# Altium schematic sheet WARG EE Bootcamp.SchDoc
size 431 x 279 mm; SheetNumber: 1; SheetTotal: 1
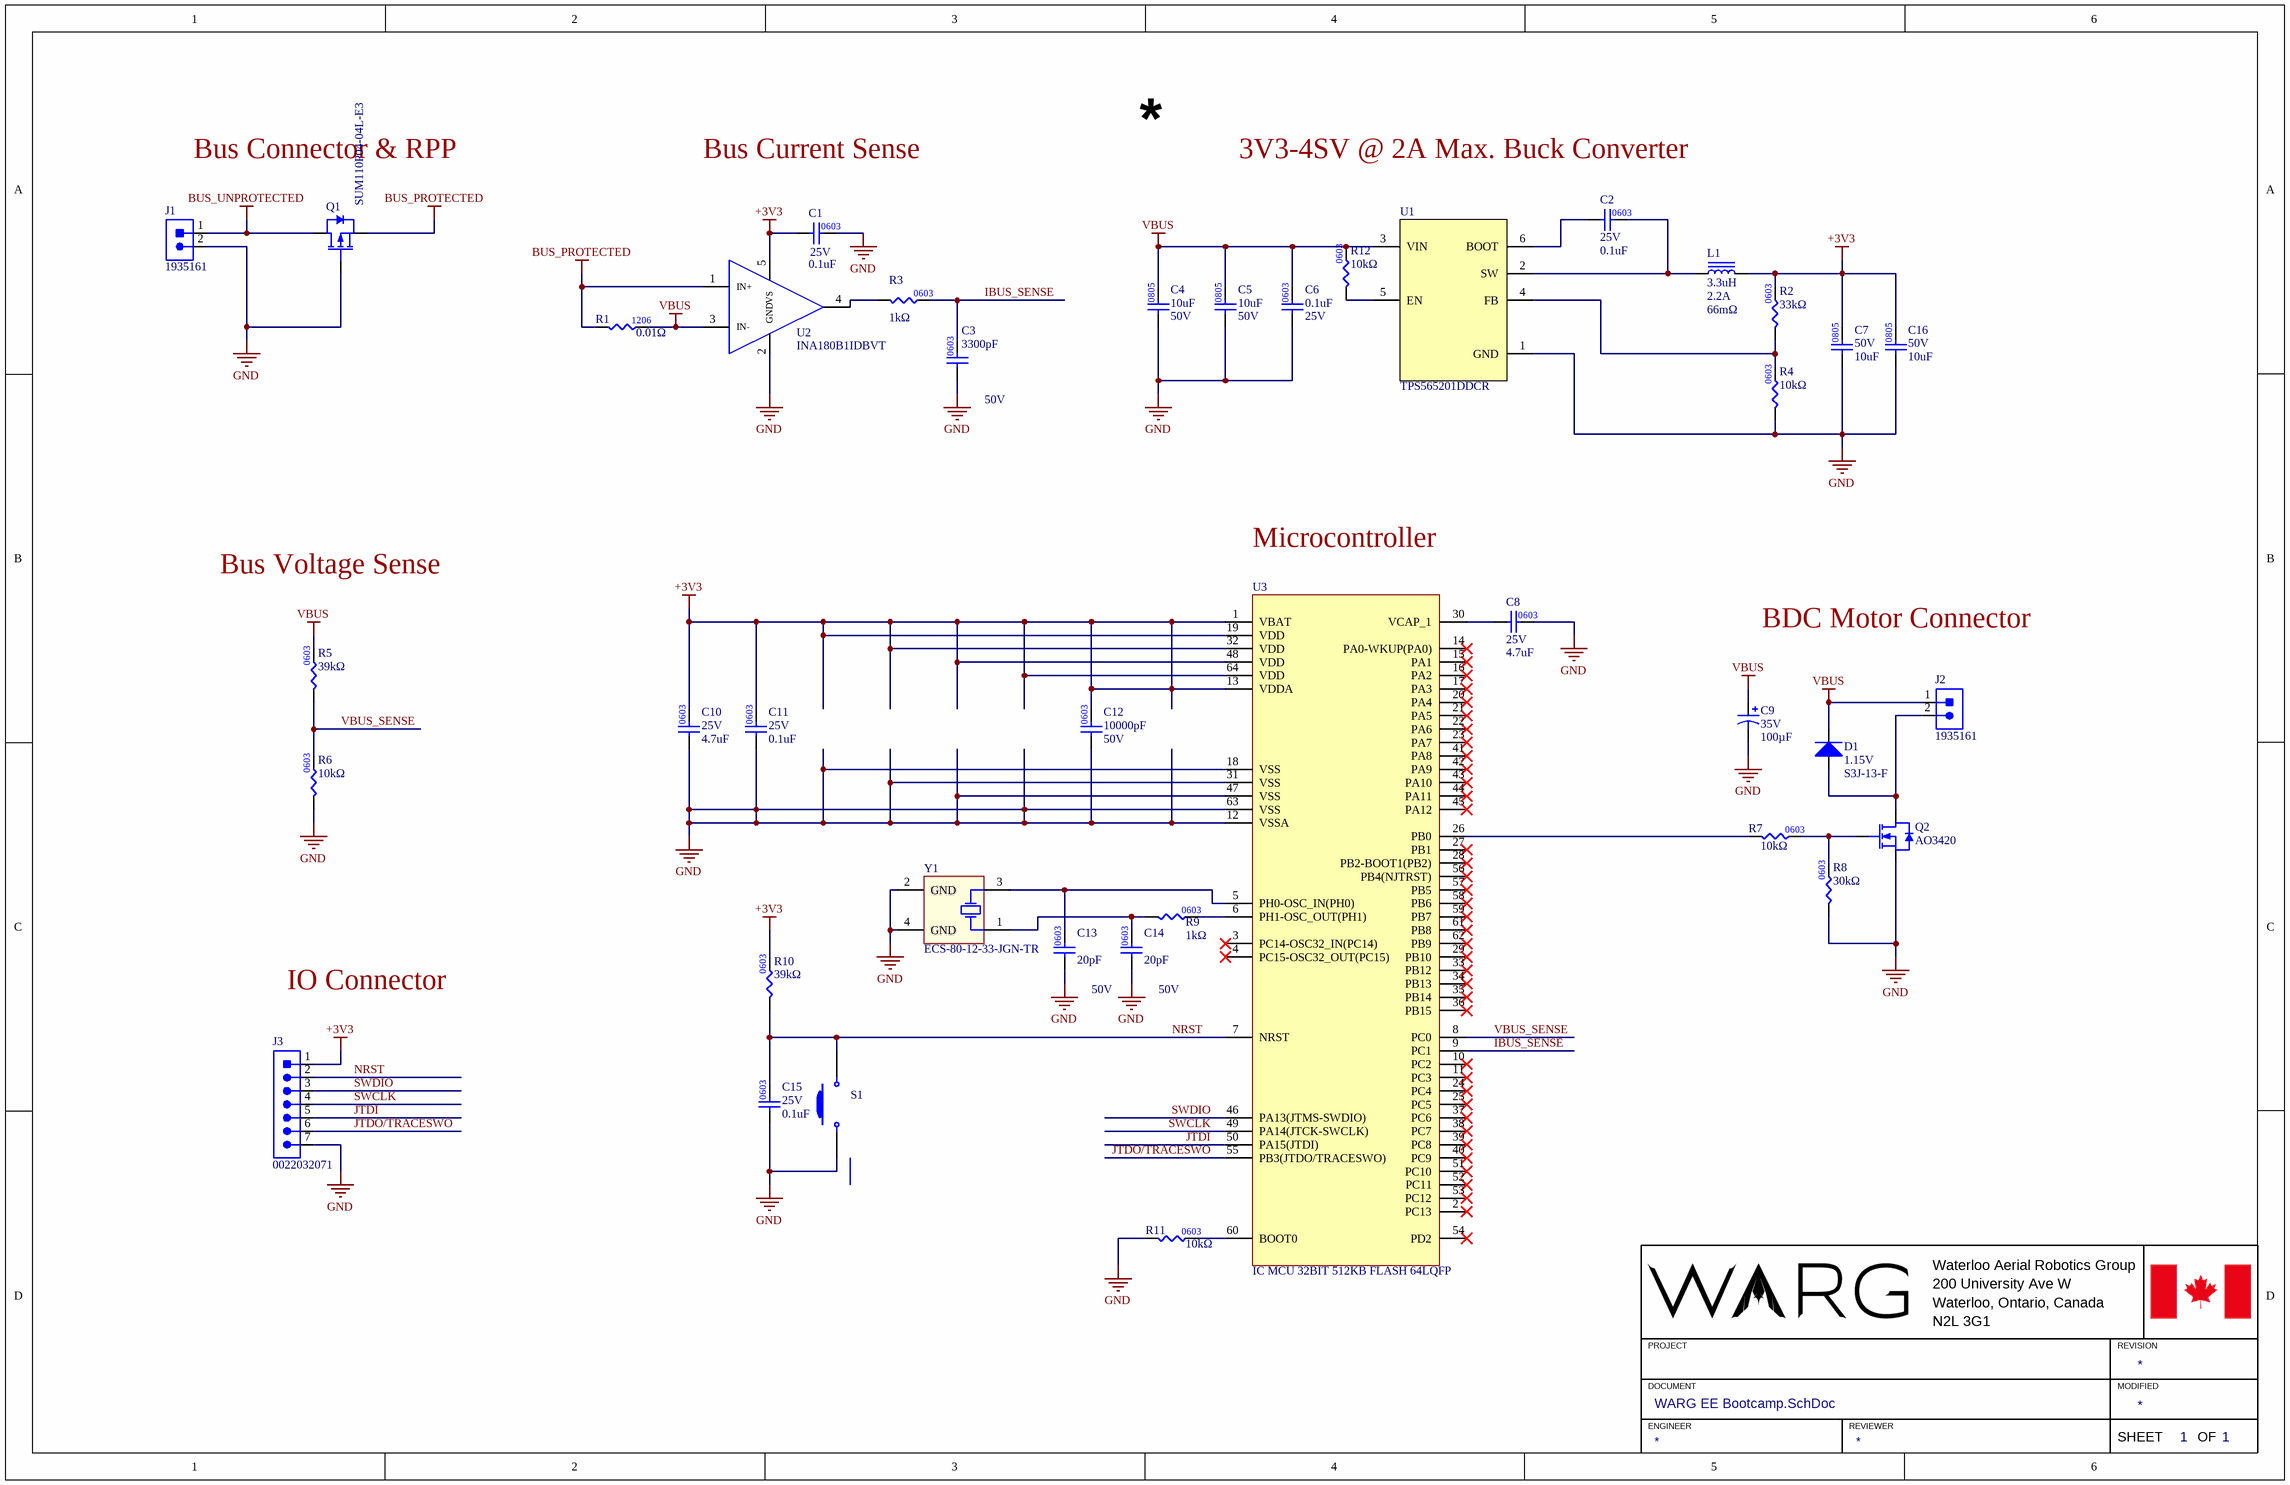
[diagram p0: WARG EE Bootcamp.SchDoc]

## Parts
C1  value 0.1uF  Voltage: 25V  [CAP0603]  (hidden comment: CAP CER 0.1UF 25V X7R ±10% 0603)
C2  value 0.1uF  Voltage: 25V  [CAP0603]  (hidden comment: CAP CER 0.1UF 25V X7R ±10% 0603)
C3  value 3300pF  Voltage Rating: 50V  [CAP0603]  (hidden comment: CAP CER 3300PF 50V C0G/NP0 0603)
C4  value 10uF  Voltage: 50V  [CAP0805]  (hidden comment: CAP CER 10UF 50V X5R ±10% 0805)
C5  value 10uF  Voltage: 50V  [CAP0805]  (hidden comment: CAP CER 10UF 50V X5R ±10% 0805)
C6  value 0.1uF  Voltage: 25V  [CAP0603]  (hidden comment: CAP CER 0.1UF 25V X7R ±10% 0603)
C7  value 10uF  Voltage: 50V  [CAP0805]  (hidden comment: CAP CER 10UF 50V X5R ±10% 0805)
C8  value 4.7uF  Voltage: 25V  [CAP0603]  (hidden comment: CAP CER 4.7UF 25V X6S ±10% 0603)
C9  value 100µF  Voltage Rating: 35V  [RADIAL_CORNELL_D]  (hidden comment: CAP ALUM 100UF 20% 35V SMD)
C10  value 4.7uF  Voltage: 25V  [CAP0603]  (hidden comment: CAP CER 4.7UF 25V X6S ±10% 0603)
C11  value 0.1uF  Voltage: 25V  [CAP0603]  (hidden comment: CAP CER 0.1UF 25V X7R ±10% 0603)
C12  value 10000pF  Voltage Rating: 50V  [CAP0603]  (hidden comment: CAP CER 10000PF 50V X7R 0603)
C13  value 20pF  Voltage Rating: 50V  [CAP0603]  (hidden comment: CAP CER 20PF 50V C0G/NP0 0201)
C14  value 20pF  Voltage Rating: 50V  [CAP0603]  (hidden comment: CAP CER 20PF 50V C0G/NP0 0201)
C15  value 0.1uF  Voltage: 25V  [CAP0603]  (hidden comment: CAP CER 0.1UF 25V X7R ±10% 0603)
C16  value 10uF  Voltage: 50V  [CAP0805]  (hidden comment: CAP CER 10UF 50V X5R ±10% 0805)
D1  Forward Voltage: 1.15V  Manufacturer Part Number 1: S3J-13-F  [SMC]  (hidden comment: DIODE GEN PURP 600V 3A SMC)
J1  CON_2POS_SCREW_TERM  [1935161]  (value not drawn)
J2  CON_2POS_SCREW_TERM  [1935161]  (value not drawn)
J3  CONN HEADER VERT 7POS 2.54MM  [0022284070]  (value not drawn)
L1  value 3.3uH  Current Rating: 2.2A  DC Resistance: 66mΩ
Q1  SUM110P04-04L-E3  [TO-263 (D²Pak)]  (value not drawn)
Q2  MOSFET N-CH 20V 6A SOT23-3L  [SOT23-3]  (value not drawn)
R1  value 0.01Ω  [RES1206]
R2  value 33kΩ  [RES0603]  (hidden comment: RES 33K OHM 1% 1/10W 0603)
R3  value 1kΩ  [RES0603]  (hidden comment: RES 1K OHM 1% 1/10W 0603)
R4  value 10kΩ  [RES0603]  (hidden comment: RES 10K OHM 1% 1/10W 0603)
R5  value 39kΩ  [RES0603]  (hidden comment: RES 39K OHM 1% 1/10W 0603)
R6  value 10kΩ  [RES0603]  (hidden comment: RES 10K OHM 1% 1/10W 0603)
R7  value 10kΩ  [RES0603]  (hidden comment: RES 10K OHM 1% 1/10W 0603)
R8  value 30kΩ  [RES0603]  (hidden comment: RES 30K OHM 1% 1/10W 0603)
R9  value 1kΩ  [RES0603]  (hidden comment: RES 1K OHM 1% 1/10W 0603)
R10  value 39kΩ  [RES0603]
R11  value 10kΩ  [RES0603]  (hidden comment: RES 10K OHM 1% 1/10W 0603)
R12  value 10kΩ  [RES0603]  (hidden comment: RES 10K OHM 1% 1/10W 0603)
S1  435151014824  [435151014824]  (value not drawn)
U1  IC REG BUCK ADJ 5A TSOT23-6  [SOT23-6]  (value not drawn)
U2  IC CURR SENSE 1 CIRCUIT SOT23-5  [SOT23-5]  (value not drawn)
U3  IC MCU 32BIT 512KB FLASH 64LQFP  [STM_LQFP64_N]
Y1  CRYSTAL 8MHZ 12PF SMD  (value not drawn)

## Nets
+3V3: C1.1 C7.2 C10.2 C11.2 C12.2 C16.2 J3.1 L1.2 R2.2 R10.2 U2.5(VS) U3.1(VBAT) U3.13(VDDA) U3.19(VDD) U3.32(VDD) U3.48(VDD) U3.64(VDD)
BUS_PROTECTED: Q1.1(Source) R1.1 U2.1(IN+)
BUS_UNPROTECTED: J1.1 Q1.3(Drain)
GND: C1.2 C3.1 C4.1 C5.1 C6.1 C7.1 C8.2 C9.2 C10.1 C11.1 C12.1 C13.1 C14.1 C15.1 C16.1 J1.2 J3.7 Q1.2(Gate) Q2.1(Source) R4.1 R6.1 R8.1 R11.1 S1.1 U1.1(GND) U2.2(GND) U3.12(VSSA) U3.18(VSS) U3.31(VSS) U3.47(VSS) U3.63(VSS) Y1.2(GND) Y1.4(GND)
VBUS: C4.2 C5.2 C6.2 C9.1 D1.2(K) J2.1 R1.2 R5.2 R12.2 U1.3(VIN) U2.3(IN-)
IBUS_SENSE: C3.2 R3.2 U3.9(PC1)
JTDI: J3.5 U3.50(PA15(JTDI))
JTDO/TRACESWO: J3.6 U3.55(PB3(JTDO/TRACESWO))
NRST: C15.2 J3.2 R10.1 S1.2 U3.7(NRST)
SWCLK: J3.4 U3.49(PA14(JTCK-SWCLK))
SWDIO: J3.3 U3.46(PA13(JTMS-SWDIO))
VBUS_SENSE: R5.1 R6.2 U3.8(PC0)
NetC2_1: C2.1 U1.6(BOOT)
NetC2_2: C2.2 L1.1 U1.2(SW)
NetC8_1: C8.1 U3.30(VCAP_1)
NetC13_2: C13.2 U3.5(PH0-OSC_IN(PH0)) Y1.3(OUT/IN)
NetC14_2: C14.2 R9.1 Y1.1(IN/OUT)
NetD1_1: D1.1(A) J2.2 Q2.3(Drain)
NetQ2_2: Q2.2(Gate) R7.2 R8.2
NetR2_1: R2.1 R4.2 U1.4(FB)
NetR3_1: R3.1 U2.4(OUT)
NetR7_1: R7.1 U3.26(PB0)
NetR9_2: R9.2 U3.6(PH1-OSC_OUT(PH1))
NetR11_2: R11.2 U3.60(BOOT0)
NetR12_1: R12.1 U1.5(EN)

Not connected (* = marked no-connect by the designer): U3 2(PC13)* 3(PC14-OSC32_IN(PC14))* 4(PC15-OSC32_OUT(PC15))* 10(PC2)* 11(PC3)* 14(PA0-WKUP(PA0))* 15(PA1)* 16(PA2)* 17(PA3)* 20(PA4)* 21(PA5)* 22(PA6)* 23(PA7)* 24(PC4)* 25(PC5)* 27(PB1)* 28(PB2-BOOT1(PB2))* 29(PB10)* 33(PB12)* 34(PB13)* 35(PB14)* 36(PB15)* 37(PC6)* 38(PC7)* 39(PC8)* 40(PC9)* 41(PA8)* 42(PA9)* 43(PA10)* 44(PA11)* 45(PA12)* 51(PC10)* 52(PC11)* 53(PC12)* 54(PD2)* 56(PB4(NJTRST))* 57(PB5)* 58(PB6)* 59(PB7)* 61(PB8)* 62(PB9)*

## Notes on the sheet
- Bus Connector & RPP
- Bus Current Sense
- 3V3-4SV @ 2A Max. Buck Converter
- Microcontroller
- Bus Voltage Sense
- BDC Motor Connector
- IO Connector
- Waterloo Aerial Robotics Group
- 200 University Ave W
- PROJECT
- Waterloo, Ontario, Canada
- N2L 3G1
- REVISION
- DOCUMENT
- ENGINEER
- REVIEWER
- MODIFIED
- SHEET
- OF

## Library data of the parts
C1 C2 C6 C11 C15 = GCM188R71E104KA57D: Manufacturer 1: Murata Electronics; Supplier 1: Digi-Key; Supplier Part Number 1: 490-6051-1-ND; Manufacturer Part Number 1: GCM188R71E104KA57D; Temperature Coefficient: X7R; Package: 0603; Tolerance: ±10%; Mounting Type: SMD
C3 = GRM1885C1H332JA01D: Manufacturer 1: Murata Electronics; Tolerance: ±5%; Temperature Coefficient: C0G; Supplier 1: Digi-Key; Manufacturer Part Number 1: GRM1885C1H332JA01D; Supplier Part Number 1: 490-6385-1-ND; Package: 0603; Mounting Type: SMD; ComponentLink1URL: https://datasheet.ciiva.com/6270/product-6270530.pdf?src-supplier=Digi-Key; ComponentLink1Description: https://datasheet.ciiva.com/6270/product-6270530.pdf?src-supplier=Digi-Key; ComponentLink2URL: https://datasheet.ciiva.com/29202/450783-da-01-en-vs-kondensator-0603-29202805.pdf?src-supplier=Conrad; ComponentLink2Description: https://datasheet.ciiva.com/29202/450783-da-01-en-vs-kondensator-0603-29202805.pdf?src-supplier=Conrad; ComponentLink3URL: https://datasheet.ciiva.com/5417/product-5417082.pdf?src-supplier=Mouser; ComponentLink3Description: https://datasheet.ciiva.com/5417/product-5417082.pdf?src-supplier=Mouser
C4 C5 C7 C16 = GRM21BR61H106KE43L: Manufacturer 1: Murata Electronics; Manufacturer Part Number 1: GRM21BR61H106KE43L; Supplier 1: Digi-Key; Supplier Part Number 1: 490-18663-1-ND; Temperature Coefficient: X5R; Package: 0805; Mounting Type: Surface Mount; Tolerance: ±10%
C8 C10 = GRM188C81E475KE11D: Manufacturer 1: Murata Electronics; Supplier 1: Digi-Key; Supplier Part Number 1: 490-7199-1-ND; Manufacturer Part Number 1: GRM188C81E475KE11D; Tolerance: ±10%; Temperature Coefficient: X6S; Mounting Type: SMD; Package: 0603
C9 = 35TKV100M8X10.5: Manufacturer 1: Rubycon; Manufacturer Part Number 1: 35TKV100M8X10.5; Mounting Type: SMD; Supplier 1: Digi-Key; Supplier Part Number 1: 1189-2074-1-ND; Tolerance: ±20%
C12 = C0603C103J5RAC7867: Manufacturer 1: KEMET; Tolerance: ±5%; Manufacturer Part Number 1: C0603C103J5RAC7867; Package: 0603; Mounting Type: SMD; Temperature Coefficient: X7R; Supplier 1: Digi-Key; Supplier Part Number 1: 399-C0603C103J5RAC7867CT-ND
C13 C14 = GRM0335C1H200GA01D: Manufacturer Part Number 1: GRM1885C1H332JA01D; Manufacturer 1: Murata Electronics; Temperature Coefficient: C0G; Tolerance: ±5%; Supplier 1: Digi-Key; Supplier Part Number 1: 490-6385-1-ND; Package: 0603; Mounting Type: SMD; ComponentLink1URL: https://datasheet.ciiva.com/6270/product-6270530.pdf?src-supplier=Digi-Key; ComponentLink1Description: https://datasheet.ciiva.com/6270/product-6270530.pdf?src-supplier=Digi-Key; ComponentLink2URL: https://datasheet.ciiva.com/29202/450783-da-01-en-vs-kondensator-0603-29202805.pdf?src-supplier=Conrad; ComponentLink2Description: https://datasheet.ciiva.com/29202/450783-da-01-en-vs-kondensator-0603-29202805.pdf?src-supplier=Conrad; ComponentLink3URL: https://datasheet.ciiva.com/5417/product-5417082.pdf?src-supplier=Mouser; ComponentLink3Description: https://datasheet.ciiva.com/5417/product-5417082.pdf?src-supplier=Mouser
D1 = S3J-FDICT-ND: Manufacturer 1: Diodes Incorporated; Reverse Leakage Current: 10 μA @ 600V; Package: SMC; Mounting Type: Surface Mount; Supplier Part Number 1: S3J-FDICT-ND; Continuous Reverse Voltage (Max): 600V; Average Rectified Current: 3A; Supplier 1: Digi-Key
J1 J2 = 1935161: CONN SCREW TERMINAL 2X1 5MM RA TH; Manufacturer 1: Phoenix Contact; Supplier 1: Digi-Key; Mounting Type: TH; Supplier Part Number 1: 277-1667-ND; Pitch: 5mm; Manufacturer Part Number 1: 1935161
J3 = 0022032071: Manufacturer 1: Molex; Number of Positions: 7; Mounting Type: Through Hole; Pitch: 2.54mm; Number of Rows: 1; Connector Type: Header; Contact Type: Male Pin; Supplier 1: Digi-Key; Supplier Part Number 1: WM4005-ND; Manufacturer Part Number 1: 0022032071
L1 = SRN4018-2R2M: FIXED IND 2.2UH 2.9A 44 MOHM SMD; Manufacturer 1: Bourns Inc.; Manufacturer Part Number 1: SRN4018-3R3M; Supplier 1: Digi-Key; Supplier Part Number 1: SRN4018-3R3MCT-ND; Mounting Type: SMD
Q2 = AO3420: Manufacturer 1: Alpha & Omega Semiconductor Inc.; Gate to Source Voltage (Vgs) Max. @ Vgs = 4.5V: ±12V; FET Type: N-Channel; Drain to Source Resistance On (Rds(on)) Max.: 24mΩ; Gate to Source Voltage Threshold (Vgs(th)) Max.: 1V; Supplier 1: Digi-Key; Supplier Part Number 1: 785-1014-1-ND; Package: SOT23-3; Drain to Source Voltage (Vdss) Max.: 20V; Manufacturer Part Number 1: AO3420; Mounting Type: SMD; Continuous Drain Current (Id) TA=25°C: 6A
R1 = PF1206FRF070R01L: RES 0.01 OHM 1% 1/4W 1206; Manufacturer 1: YAGEO; Supplier 1: Digi-Key; Manufacturer Part Number 1: PF1206FRF070R01L; Supplier Part Number 1: 311-0.01AJCT-ND; Package: 1206; Tolerance: ±1%; Power Rating: 1/4W; Mounting Type: SMD
R2 = RC0603FR-0733KL: Manufacturer Part Number 1: RC0603FR-0730KL; Manufacturer 1: YAGEO; Supplier 1: Digi-Key; Supplier Part Number 1: 311-30.0KHRCT-ND; Package: 0603; Tolerance: ±1%; Power Rating: 1/10W; Mounting Type: SMD
R3 R9 = RC0603FR-071KL: Manufacturer 1: YAGEO; Supplier 1: Digi-Key; Manufacturer Part Number 1: RC0603FR-071KL; Mounting Type: SMD; Package: 0603; Tolerance: ±1%; Supplier Part Number 1: 311-1.00KHRCT-ND; Power Rating: 1/10W
R4 R6 R7 R11 R12 = RC0603FR-0710KL: Manufacturer 1: YAGEO; Supplier 1: Digi-Key; Manufacturer Part Number 1: RC0603FR-0710KL; Supplier Part Number 1: 311-10.0KHRCT-ND; Package: 0603; Tolerance: ±1%; Power Rating: 1/10W; Mounting Type: SMD
R5 = RC0603FR-0739KL: Manufacturer Part Number 1: RC0603FR-0730KL; Manufacturer 1: YAGEO; Supplier 1: Digi-Key; Supplier Part Number 1: 311-30.0KHRCT-ND; Package: 0603; Tolerance: ±1%; Power Rating: 1/10W; Mounting Type: SMD
R8 = RC0603FR-0730KL: Manufacturer 1: YAGEO; Supplier 1: Digi-Key; Manufacturer Part Number 1: RC0603FR-0730KL; Supplier Part Number 1: 311-30.0KHRCT-ND; Package: 0603; Tolerance: ±1%; Power Rating: 1/10W; Mounting Type: SMD
R10 = RC0603FR-0739KL: RES 39K OHM 1% 1/10W 0603; Manufacturer Part Number 1: RC0603FR-0730KL; Manufacturer 1: YAGEO; Supplier 1: Digi-Key; Supplier Part Number 1: 311-30.0KHRCT-ND; Package: 0603; Tolerance: ±1%; Power Rating: 1/10W; Mounting Type: SMD
S1 = 435151014824: SMT 3.0 X 2.6 MM TACT SWITCH WIT; Manufacturer 1: Würth Elektronik; Supplier 1: Digi-Key; Supplier Part Number 1: 732-435151014824CT-ND; Manufacturer Part Number 1: 435151014824
U1 = TPS565201DDCR: Manufacturer 1: Texas Instruments; Supplier 1: Digi-Key; Supplier Part Number 1: 296-49006-1-ND; Mounting Type: Surface Mount; Package: SOT-23-6; Manufacturer Part Number 1: TPS565201DDCR
U2 = INA180B1IDBVT: Manufacturer 1: Texas Instruments; Supplier Part Number 1: 296-46631-1-ND; Supplier 1: Digi-Key; Manufacturer Part Number 1: INA180B1IDBVT
U3 = STM32F446RET6: Manufacturer 1: STMicroelectronics; Supplier 1: Digi-Key; Supplier Part Number 1: 497-15376-ND; Manufacturer Part Number 1: STM32F446RET6
Y1 = ECS-80-12-33-JGN-TR: 8 MHz ±20ppm Crystal 12pF 400 Ohms 4-SMD; Manufacturer 1: ECS Inc.; Frequency Tolerance: ±10ppm; Load Capacitance: 10pF; Equivalent Series Resistance: 50Ω; Supplier Part Number 1: XC3065CT-ND; Supplier 1: Digi-Key; Frequency: 8MHz; Frequency Stability: ±20ppm; Manufacturer Part Number 1: ECS-80-12-33-JGN-TR